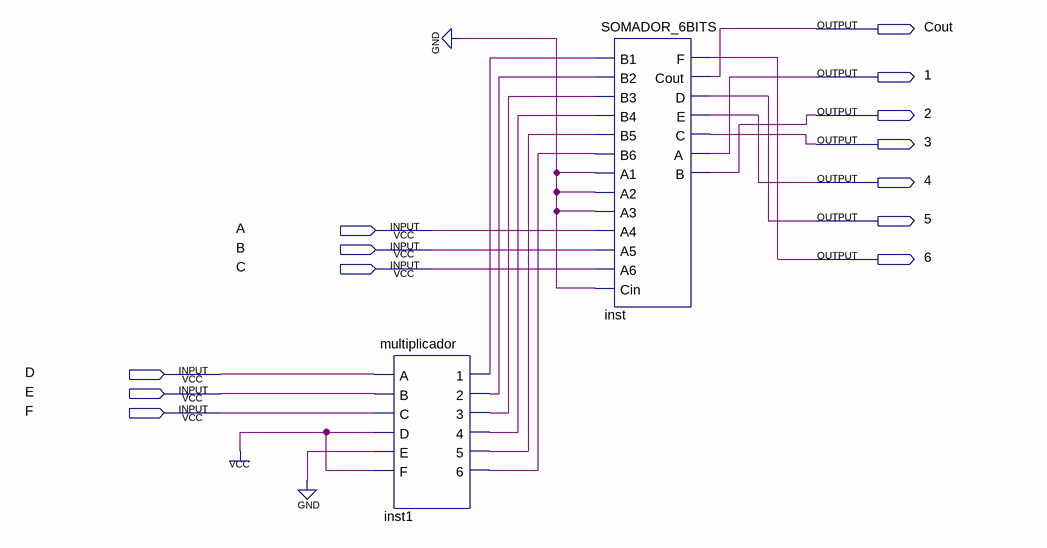
[diagram p0: schematic sheet]
// Quartus schematic CODIFICADOR.bdf as structural Verilog: 2 symbols, 13 pins
module CODIFICADOR (
  input  A,
  input  B,
  input  C,
  input  D,
  input  E,
  input  F,
  output Cout,
  output \1 ,
  output \2 ,
  output \3 ,
  output \4 ,
  output \5 ,
  output \6 
);

  wire inst1_1, inst1_2, inst1_3, inst1_4, inst1_5, inst1_6;

  multiplicador inst1 (
    .A(D), .B(E), .C(F), .D(1'b1), .E(1'b0), .F(1'b1), .\1 (inst1_1), .\2 (inst1_2), .\3 (inst1_3),
    .\4 (inst1_4), .\5 (inst1_5), .\6 (inst1_6));
  SOMADOR_6BITS inst (
    .B1(inst1_1), .B2(inst1_2), .B3(inst1_3), .B4(inst1_4), .B5(inst1_5), .B6(inst1_6), .A1(1'b0), .A2(1'b0),
    .A3(1'b0), .A4(A), .A5(B), .A6(C), .Cin(1'b0), .F(\6 ), .Cout(Cout), .D(\5 ), .E(\4 ), .C(\3 ), .A(\1 ),
    .B(\2 ));
endmodule
